# EAGLE schematic keypad 0.1 (EAGLE 7.7.0)
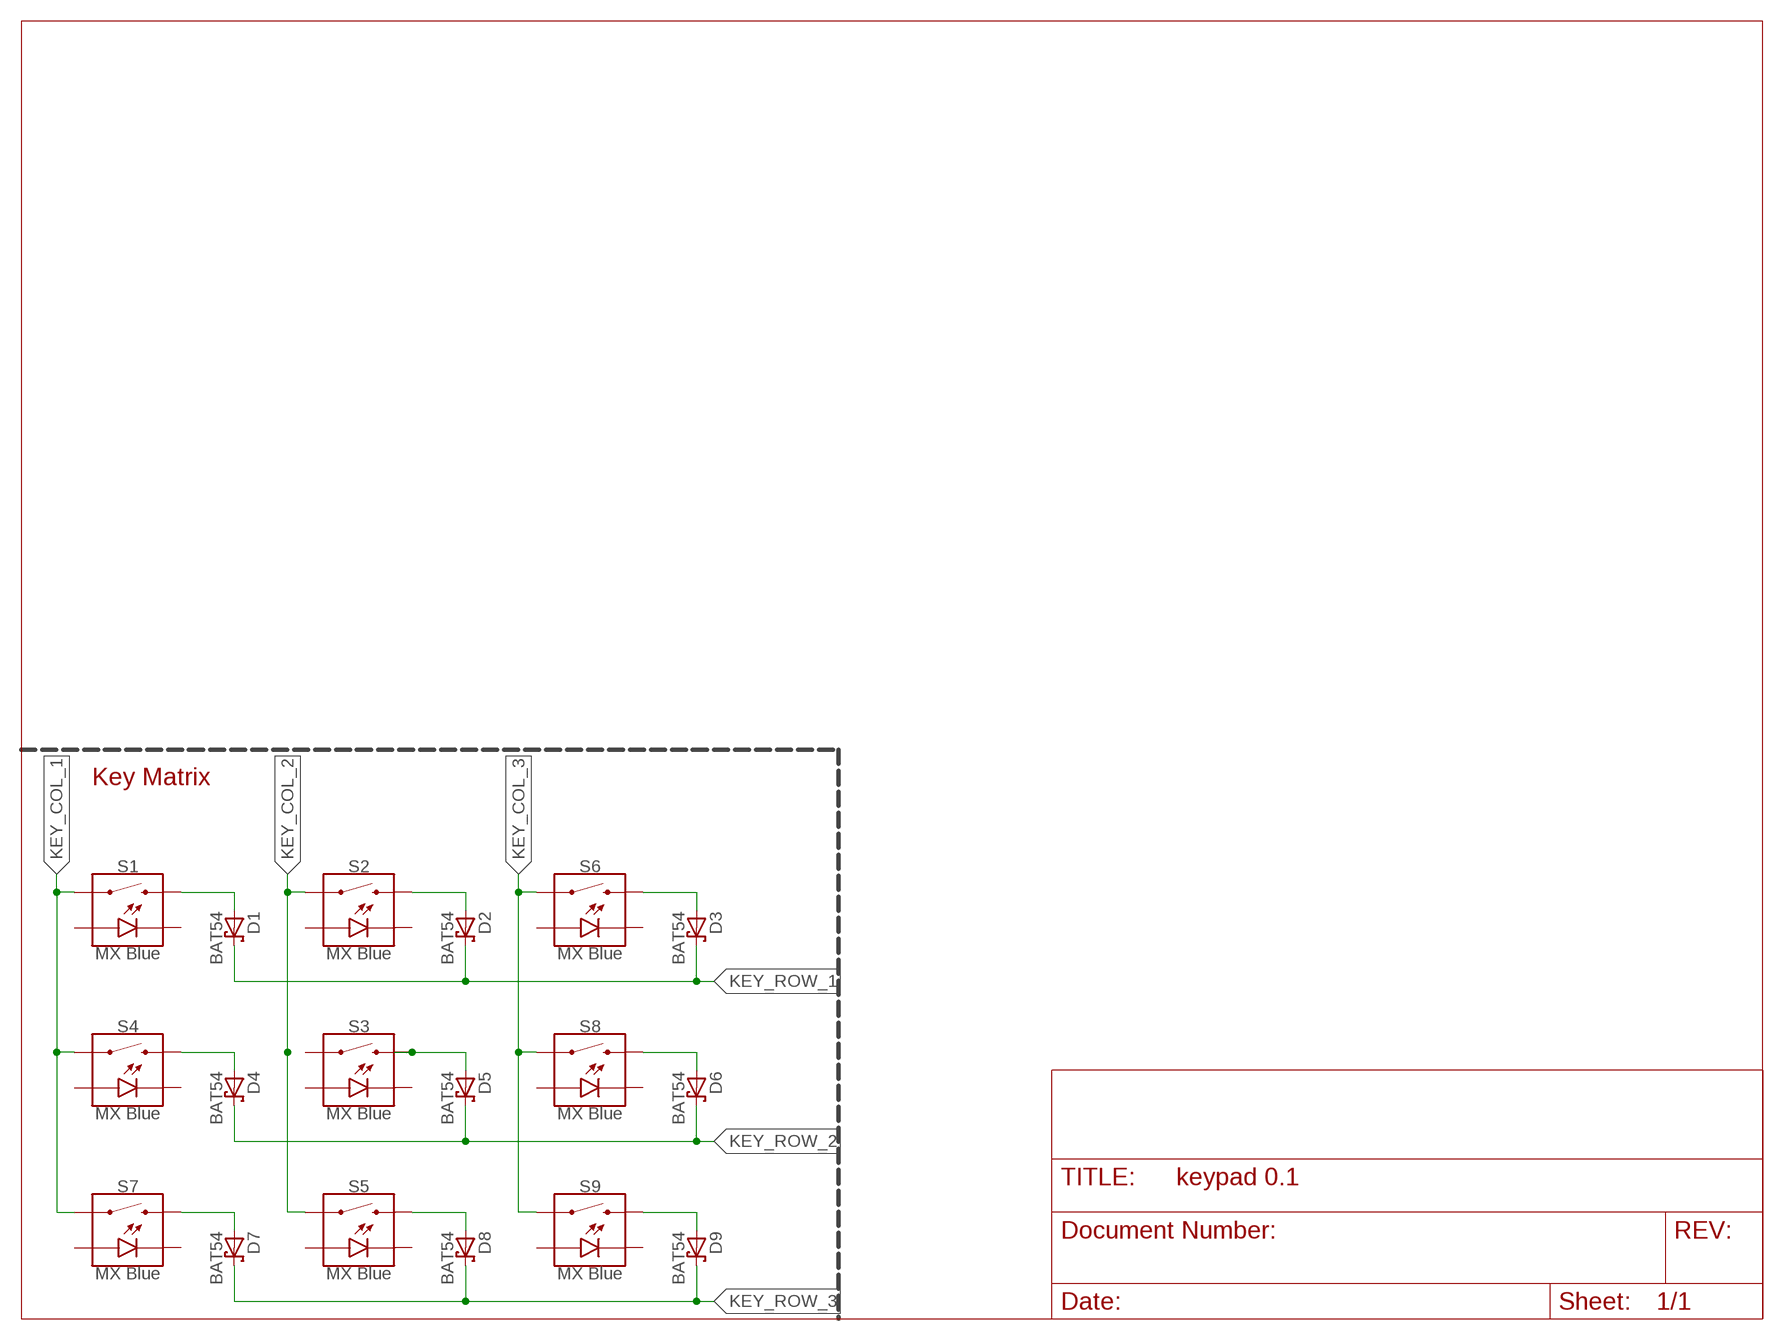
[diagram p0: schematic, sheet 1]

## Parts
D1  BAT54  [SOT23]
D2  BAT54  [SOT23]
D3  BAT54  [SOT23]
D4  BAT54  [SOT23]
D5  BAT54  [SOT23]
D6  BAT54  [SOT23]
D7  BAT54  [SOT23]
D8  BAT54  [SOT23]
D9  BAT54  [SOT23]
S1  MX Blue  MOMENTARY-SWITCH-SPST-LED-PTH-CHERRY  [CHERRY-MX-LED]
S2  MX Blue  MOMENTARY-SWITCH-SPST-LED-PTH-CHERRY  [CHERRY-MX-LED]
S3  MX Blue  MOMENTARY-SWITCH-SPST-LED-PTH-CHERRY  [CHERRY-MX-LED]
S4  MX Blue  MOMENTARY-SWITCH-SPST-LED-PTH-CHERRY  [CHERRY-MX-LED]
S5  MX Blue  MOMENTARY-SWITCH-SPST-LED-PTH-CHERRY  [CHERRY-MX-LED]
S6  MX Blue  MOMENTARY-SWITCH-SPST-LED-PTH-CHERRY  [CHERRY-MX-LED]
S7  MX Blue  MOMENTARY-SWITCH-SPST-LED-PTH-CHERRY  [CHERRY-MX-LED]
S8  MX Blue  MOMENTARY-SWITCH-SPST-LED-PTH-CHERRY  [CHERRY-MX-LED]
S9  MX Blue  MOMENTARY-SWITCH-SPST-LED-PTH-CHERRY  [CHERRY-MX-LED]

## Nets
KEY_COL_1: S1.S1 S4.S1 S7.S1
KEY_COL_2: S2.S1 S5.S1
KEY_COL_3: S6.S1 S8.S1 S9.S1
KEY_ROW_1: D1.3(C) D2.3(C) D3.3(C)
KEY_ROW_2: D4.3(C) D5.3(C) D6.3(C)
KEY_ROW_3: D7.3(C) D8.3(C) D9.3(C)
N$1: D1.1(A) S1.S2
N$2: D4.1(A) S4.S2
N$3: D7.1(A) S7.S2
N$4: D8.1(A) S5.S2
N$5: D5.1(A) S3.S2
N$6: D2.1(A) S2.S2
N$7: D3.1(A) S6.S2
N$8: D6.1(A) S8.S2
N$9: D9.1(A) S9.S2
Unconnected: S1.A S1.K(C) S2.A S2.K(C) S3.A S3.K(C) S3.S1 S4.A S4.K(C) S5.A S5.K(C) S6.A S6.K(C) S7.A S7.K(C) S8.A S8.K(C) S9.A S9.K(C)

## Notes on the sheet
- Key Matrix

## Library data of the parts
D1-D9 = diode:BAT54: Schottky Diodes Source: Fairchild .. BAT54.pdf
S1-S9 = SparkFun-Switches:MOMENTARY-SWITCH-SPST-LED: Momentary Switch (Pushbutton) - SPST - w/ LED Normally-open (NO) SPST momentary switches (buttons, pushbuttons), with a built-in LED. Variants PTH-CHERRY - Cherry MX Switch Cherry MX Keyswitches are top-of-the-line mechanical keyboard switches. They’re satisfyingly “clicky”, reliable up to tens-of-millions of key presses, and a standard in gaming and programming keyboards across the globe. This ‘blue’ version Cherry MX Switch is favored by most due to its secondary internal actuator making it less likely to “double-tap.” If you are looking for a noticeably audible and high-quality key switch, this is the perfect option for you! Cherry MX Switch <https://www.sparkfun.com/products/13834> (COM-13834) Cherry MX Switch Breakout <https://www.sparkfun.com/products/13773> (BOB-13773) PTH-12MM and PTH-12MM-KIT - 12mm Illuminated LED KIT variant is for soldering kits. There is no tStop (covering up the top side of the pads with mask). This helps the beginner see which side they should be soldering too. LED Tactile Button Breakout <https://www.sparkfun.com/products/10467> (BOB-10467) LED Tactile Button - Red <https://www.sparkfun.com/products/10442> (COM-10442) LED Tactile Button - Blue <https://www.sparkfun.com/products/10443> (COM-10443) LED Tactile Button - Green <https://www.sparkfun.com/products/10440> (COM-10440) LED Tactile Button - Orange <https://www.sparkfun.com/products/10441> (COM-10441) LED Tactile Button - White <https://www.sparkfun.com/products/10439> (COM-10439); SF_ID: COM-13834